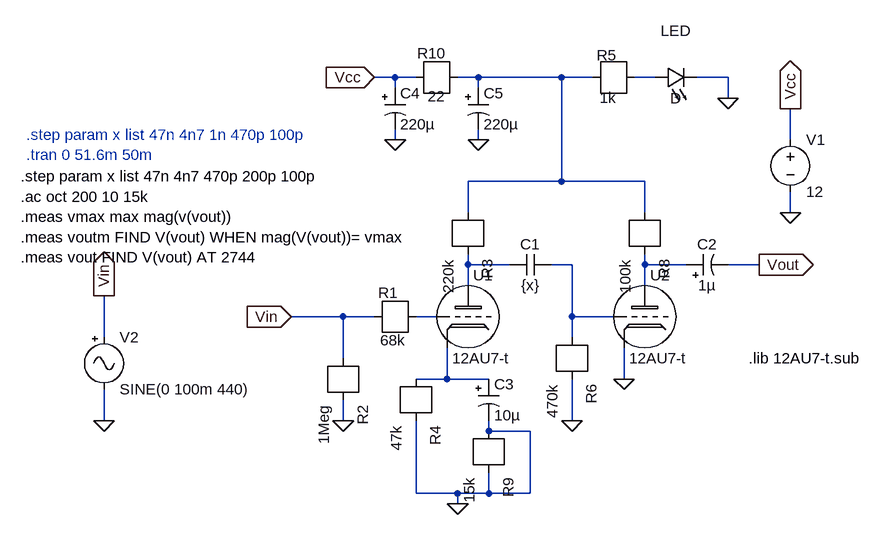
[diagram p0: schematic tubetreble.asc]
tubetreble.asc, the LTspice schematic file:
Version 4
SHEET 1 1428 824
WIRE 496 96 464 96
WIRE 528 96 496 96
WIRE 624 96 592 96
WIRE 752 96 624 96
WIRE 800 96 752 96
WIRE 896 96 864 96
WIRE 1008 96 960 96
WIRE 496 112 496 96
WIRE 624 112 624 96
WIRE 1008 128 1008 96
WIRE 496 192 496 176
WIRE 624 192 624 176
WIRE 1104 192 1104 144
WIRE 752 256 752 96
WIRE 752 256 608 256
WIRE 880 256 752 256
WIRE 608 304 608 256
WIRE 880 304 880 256
WIRE 1104 304 1104 272
WIRE 608 384 608 368
WIRE 672 384 608 384
WIRE 768 384 736 384
WIRE 880 384 880 368
WIRE 944 384 880 384
WIRE 1056 384 1008 384
WIRE 608 416 608 384
WIRE 880 416 880 384
WIRE 416 464 336 464
WIRE 464 464 416 464
WIRE 560 464 528 464
WIRE 768 464 768 384
WIRE 832 464 768 464
WIRE 48 496 48 432
WIRE 768 496 768 464
WIRE 416 528 416 464
WIRE 576 560 576 512
WIRE 576 560 528 560
WIRE 640 560 576 560
WIRE 848 560 848 512
WIRE 48 624 48 576
WIRE 416 624 416 592
WIRE 768 624 768 560
WIRE 640 640 640 624
WIRE 704 640 640 640
WIRE 528 736 528 624
WIRE 592 736 528 736
WIRE 640 736 640 704
WIRE 640 736 592 736
WIRE 704 736 704 640
WIRE 704 736 640 736
WIRE 592 752 592 736
FLAG 464 96 Vcc
IOPIN 464 96 In
FLAG 1104 304 0
FLAG 1104 144 Vcc
IOPIN 1104 144 Out
FLAG 1008 128 0
FLAG 496 192 0
FLAG 624 192 0
FLAG 336 464 Vin
IOPIN 336 464 In
FLAG 592 752 0
FLAG 416 624 0
FLAG 1056 384 Vout
IOPIN 1056 384 Out
FLAG 48 432 Vin
IOPIN 48 432 Out
FLAG 48 624 0
FLAG 768 624 0
FLAG 848 560 0
SYMBOL 12AU7-t 608 464 R0
SYMATTR InstName U1
SYMBOL 12AU7-t 880 464 R0
SYMATTR InstName U2
SYMBOL voltage 1104 176 R0
SYMATTR InstName V1
SYMATTR Value 12
SYMBOL r 528 96 R0
WINDOW 0 46 -37 Right 2
WINDOW 3 45 29 Right 2
SYMATTR InstName R10
SYMATTR Value 22
SYMBOL r 608 304 R90
SYMATTR InstName R3
SYMATTR Value 220k
SYMBOL r 880 304 R90
SYMATTR InstName R8
SYMATTR Value 100k
SYMBOL r 800 96 R0
WINDOW 0 37 -34 Right 2
WINDOW 3 36 31 Right 2
SYMATTR InstName R5
SYMATTR Value 1k
SYMBOL LED 896 112 R270
WINDOW 0 72 32 VTop 2
WINDOW 3 0 32 VBottom 2
SYMATTR InstName LED
SYMBOL r 464 464 R0
WINDOW 0 37 -37 Right 2
WINDOW 3 48 36 Right 2
SYMATTR InstName R1
SYMATTR Value 68k
SYMBOL r 416 528 R90
SYMATTR InstName R2
SYMATTR Value 1Meg
SYMBOL r 528 560 R90
SYMATTR InstName R4
SYMATTR Value 47k
SYMBOL polcap 480 112 R0
SYMATTR InstName C4
SYMATTR Value 220µ
SYMBOL polcap 608 112 R0
SYMATTR InstName C5
SYMATTR Value 220µ
SYMBOL polcap 624 560 R0
SYMATTR InstName C3
SYMATTR Value 10µ
SYMBOL polcap 944 400 R270
WINDOW 0 32 32 VTop 2
WINDOW 3 0 32 VBottom 2
SYMATTR InstName C2
SYMATTR Value 1µ
SYMBOL cap 736 368 R90
WINDOW 0 0 32 VBottom 2
WINDOW 3 32 32 VTop 2
SYMATTR InstName C1
SYMATTR Value {x}
SYMBOL r 640 640 R90
SYMATTR InstName R9
SYMATTR Value 15k
SYMBOL signal 48 480 R0
SYMATTR InstName V2
SYMATTR Value SINE(0 100m 440)
SYMATTR Value2 AC 100m
SYMBOL r 768 496 R90
SYMATTR InstName R6
SYMATTR Value 470k
TEXT 1040 528 Left 2 !.lib 12AU7-t.sub
TEXT -72 184 Left 2 ;.step param x list 47n 4n7 1n 470p 100p\n.tran 0 51.6m 50m
TEXT -80 248 Left 2 !.step param x list 47n 4n7 470p 200p 100p\n.ac oct 200 10 15k\n.meas vmax max mag(v(vout))\n.meas voutm FIND V(vout) WHEN mag(V(vout))= vmax\n.meas vout FIND V(vout) AT 2744

The netlist it stands for:
* tubetreble.asc
XU1 N003 N006 N007 12AU7-t  ; pins Plate Grid Cathode
XU2 N005 N004 0 12AU7-t  ; pins Plate Grid Cathode
V1 Vcc 0 12
R10 N001 Vcc 22
R3 N003 N001 220k
R8 N005 N001 100k
R5 N002 N001 1k
D§LED N002 0 D
R1 N006 Vin 68k
R2 0 Vin 1Meg
R4 0 N007 47k
C4 Vcc 0 220µ
C5 N001 0 220µ
C3 N007 0 10µ
C2 N005 Vout 1µ
C1 N004 N003 {x}
R9 0 0 15k
V2 Vin 0 SINE(0 100m 440) AC 100m
R6 0 N004 470k
.model D D
.lib standard.dio
.lib 12AU7-t.sub
* .step param x list 47n 4n7 1n 470p 100p
* .tran 0 51.6m 50m
.step param x list 47n 4n7 470p 200p 100p
.ac oct 200 10 15k
.meas vmax max mag(v(vout))
.meas voutm FIND V(vout) WHEN mag(V(vout))= vmax
.meas vout FIND V(vout) AT 2744
.lib 12AU7-t.sub
.backanno
.end